# EAGLE design Schemat (EAGLE 6.1)
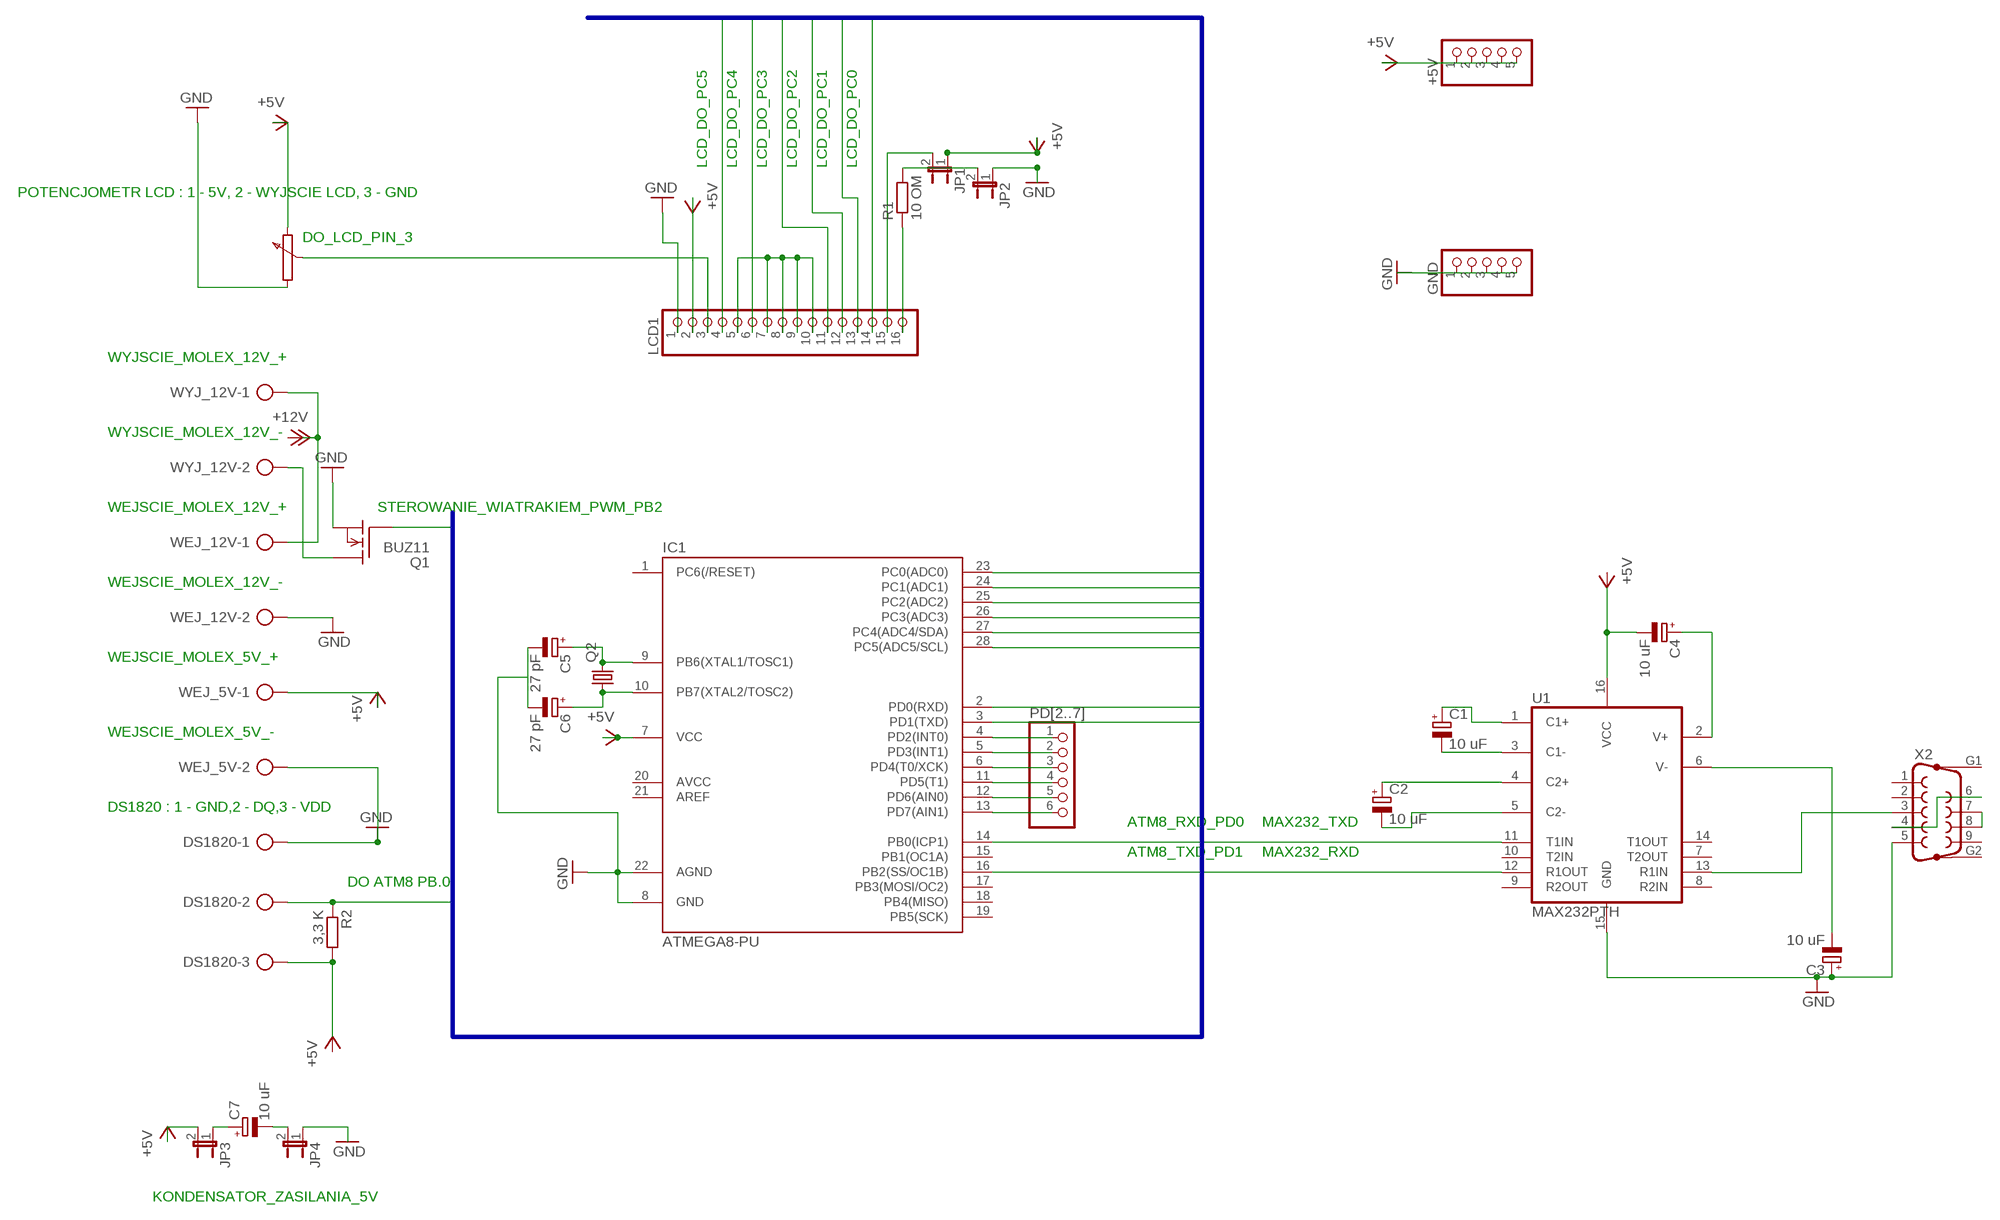
[diagram p0: schematic, sheet 1]

## Parts
+5V  PINHD-1X5  [1X05]
C1  10 uF  CPOL-EUE5-10.5  [E5-10,5]
C2  10 uF  CPOL-EUE5-10.5  [E5-10,5]
C3  10 uF  CPOL-EUE5-10.5  [E5-10,5]
C4  10 uF  CPOL-EUE5-10.5  [E5-10,5]
C5  27 pF  CPOL-EUE5-10.5  [E5-10,5]
C6  27 pF  CPOL-EUE5-10.5  [E5-10,5]
C7  10 uF  CPOL-EUE5-10.5  [E5-10,5]
DS1820  AK500/3-H  [AK500/3-H]
GND  PINHD-1X5  [1X05]
IC1  ATMEGA8-PU  [DIL28-3]
JP1  JP1E  [JP1]
JP2  JP1E  [JP1]
JP3  JP1E  [JP1]
JP4  JP1E  [JP1]
LCD1  PINHD-1X16  [1X16]
PD[2..7]  PINHD-1X6  [1X06]
Q1  BUZ11  [TO220]
Q2  CRYSTALHC49S  [HC49/S]
R1  10 OM  R-EU_0207/15  [0207/15]
R2  3,3 K  R-EU_0207/15  [0207/15]
U1  MAX232PTH  [DIL16]
WEJ_5V  AK500/2-H  [AK500/2-H]
WEJ_12V  AK500/2-H  [AK500/2-H]
WYJ_12V  AK500/2-H  [AK500/2-H]
X2  F09HP  [F09HP]

## Nets
+5V: +5V.1 +5V.2 +5V.3 +5V.4 +5V.5 IC1.7(VCC) JP1.1 JP3.2 LCD1.2 WEJ_5V.1
GND: C3.+ C5.- C6.- DS1820.1 GND.1 GND.2 GND.3 GND.4 GND.5 IC1.8(GND) IC1.22(AGND) JP2.1 JP4.1 LCD1.1 Q1.3(S) U1.15(GND) WEJ_5V.2 WEJ_12V.2 X2.5
N$1: C1.- U1.3(C1-)
N$2: C1.+ U1.1(C1+)
N$3: C2.+ U1.4(C2+)
N$4: C2.- U1.5(C2-)
N$5: X2.4 X2.6
N$6: X2.7 X2.8
N$7: U1.13(R1IN) X2.3
N$8: C4.- U1.16(VCC)
N$9: C3.- U1.6(V-)
N$10: C4.+ U1.2(V+)
N$11: C7.+ JP3.1
N$12: C7.- JP4.2
N$13: IC1.4(PD2(INT0)) PD[2..7].1
N$14: IC1.5(PD3(INT1)) PD[2..7].2
N$15: DS1820.3 R2.2
N$16: IC1.6(PD4(T0/XCK)) PD[2..7].3
N$17: LCD1.3
N$18: WEJ_12V.1 WYJ_12V.1
N$19: IC1.11(PD5(T1)) PD[2..7].4
N$20: Q1.2(D) WYJ_12V.2
N$21: LCD1.5 LCD1.7 LCD1.8 LCD1.9 LCD1.10
N$22: IC1.12(PD6(AIN0)) PD[2..7].5
N$23: C5.+ IC1.9(PB6(XTAL1/TOSC1)) Q2.2
N$24: IC1.13(PD7(AIN1)) PD[2..7].6
N$29: JP1.2 LCD1.15
N$30: JP2.2 R1.2
N$32: C6.+ IC1.10(PB7(XTAL2/TOSC2)) Q2.1
N$33: LCD1.16 R1.1
PB0: DS1820.2 IC1.14(PB0(ICP1)) R2.1
PB2: IC1.16(PB2(SS/OC1B)) Q1.1(G)
PC0: IC1.23(PC0(ADC0)) LCD1.14
PC1: IC1.24(PC1(ADC1)) LCD1.13
PC2: IC1.25(PC2(ADC2)) LCD1.12
PC3: IC1.26(PC3(ADC3)) LCD1.11
PC4: IC1.27(PC4(ADC4/SDA)) LCD1.6
PC5: IC1.28(PC5(ADC5/SCL)) LCD1.4
PD0: IC1.2(PD0(RXD)) U1.11(T1IN)
PD1: IC1.3(PD1(TXD)) U1.12(R1OUT)
Unconnected: IC1.1(PC6(/RESET)) IC1.15(PB1(OC1A)) IC1.17(PB3(MOSI/OC2)) IC1.18(PB4(MISO)) IC1.19(PB5(SCK)) IC1.20(AVCC) IC1.21(AREF) U1.7(T2OUT) U1.8(R2IN) U1.9(R2OUT) U1.10(T2IN) U1.14(T1OUT) X2.1 X2.2 X2.9 X2.G1 X2.G2

## Buses
PB[0..7],PC[0..6],PD[0..7]

## Notes on the sheet
- LCD_DO_PC5 | LCD_DO_PC4 | LCD_DO_PC3 | LCD_DO_PC2 | LCD_DO_PC1 | LCD_DO_PC0
- POTENCJOMETR LCD : 1 - 5V, 2 - WYJSCIE LCD, 3 - GND
- DO_LCD_PIN_3
- WYJSCIE_MOLEX_12V_+
- WYJSCIE_MOLEX_12V_-
- WEJSCIE_MOLEX_12V_+ | STEROWANIE_WIATRAKIEM_PWM_PB2
- WEJSCIE_MOLEX_12V_-
- WEJSCIE_MOLEX_5V_+
- WEJSCIE_MOLEX_5V_-
- DS1820 : 1 - GND,2 - DQ,3 - VDD
- ATM8_RXD_PD0 | MAX232_TXD
- ATM8_TXD_PD1 | MAX232_RXD
- DO ATM8 PB.0
- KONDENSATOR_ZASILANIA_5V

## Library data of the parts
+5V GND = pinhead:PINHD-1X5: PIN HEADER
C1-C7 = rcl:CPOL-EU: POLARIZED CAPACITOR, European symbol
DS1820 = con-ptr500:AK500/3-H: CONNECTOR Aug. 2004 / PTR Meßtechnik: Die Bezeichnung der Serie AK505 wurde geändert. Es handelt sich hierbei um AK500 in horizontaler Ausführung.; OC_FARNELL: unknown; OC_NEWARK: unknown
IC1 = atmega8:ATMEGA8-PU
JP1-JP4 = jumper:JP1E: JUMPER
LCD1 = pinhead:PINHD-1X16: PIN HEADER
PD[2..7] = pinhead:PINHD-1X6: PIN HEADER
Q1 = transistor-fet:BUZ11: N-Channel Enhancement MOSFET 50V; 30A; 0,040Ohm
Q2 = crystal:CRYSTAL: CRYSTAL; OC_FARNELL: 1667008; OC_NEWARK: unknown
R1 R2 = rcl:R-EU_: RESISTOR, European symbol
U1 = SparkFun:MAX232: RS232 Transceiver Very common IC. This is generically called 'MAX232', but works with the 3V equivalent MAX3232 generic ICs. Field tested and mother approved. Spark Fun Electronics SKU : COM-00316 (DIP) and COM-00589 (SMD)
WEJ_5V WEJ_12V WYJ_12V = con-ptr500:AK500/2-H: CONNECTOR Aug. 2004 / PTR Meßtechnik: Die Bezeichnung der Serie AK505 wurde geändert. Es handelt sich hierbei um AK500 in horizontaler Ausführung.; OC_FARNELL: unknown; OC_NEWARK: unknown
X2 = con-subd:F09HP: SUB-D; OC_FARNELL: unknown; OC_NEWARK: unknown

## Board
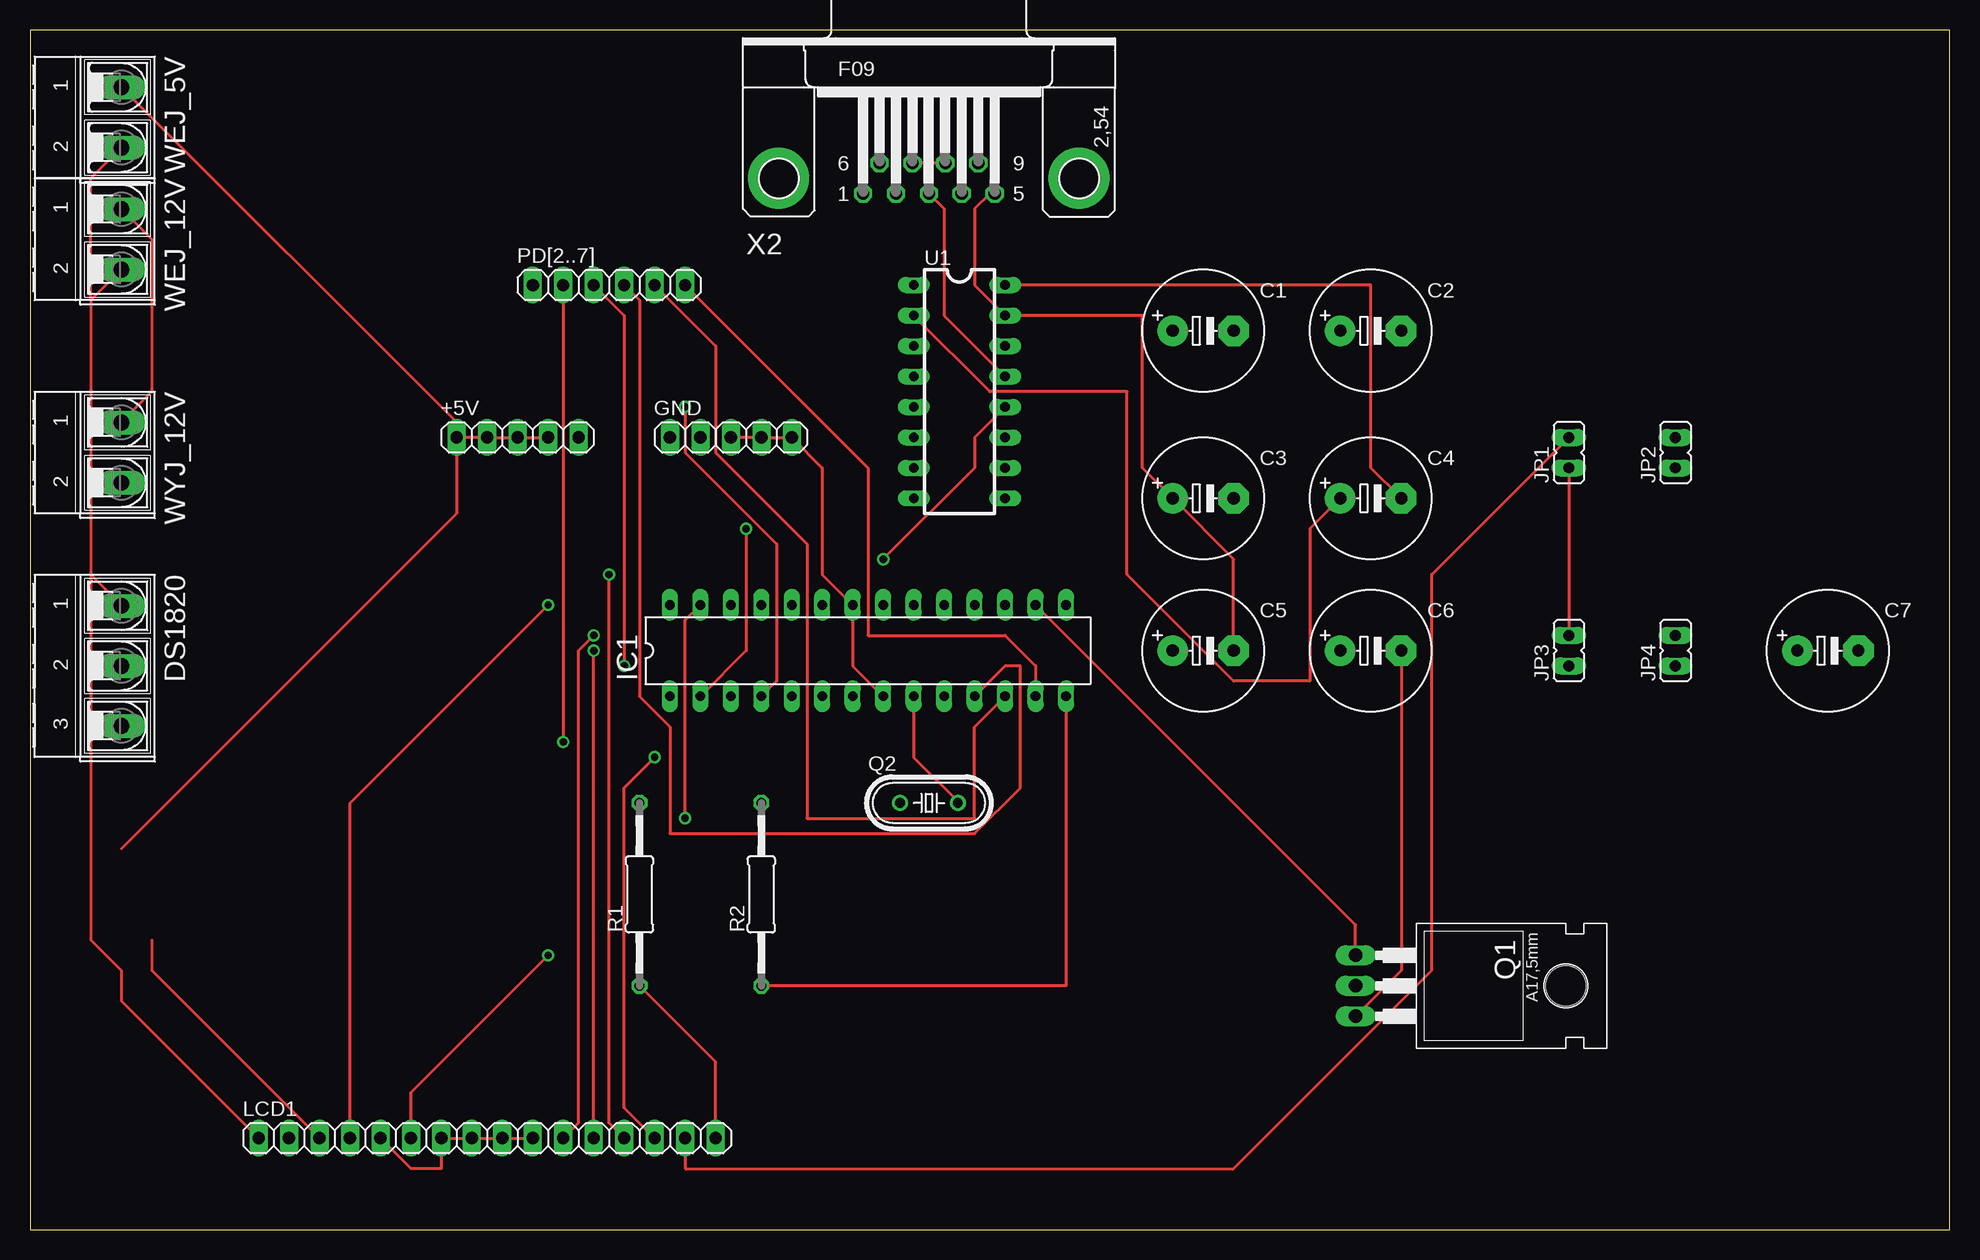
[diagram p1: board, top side]
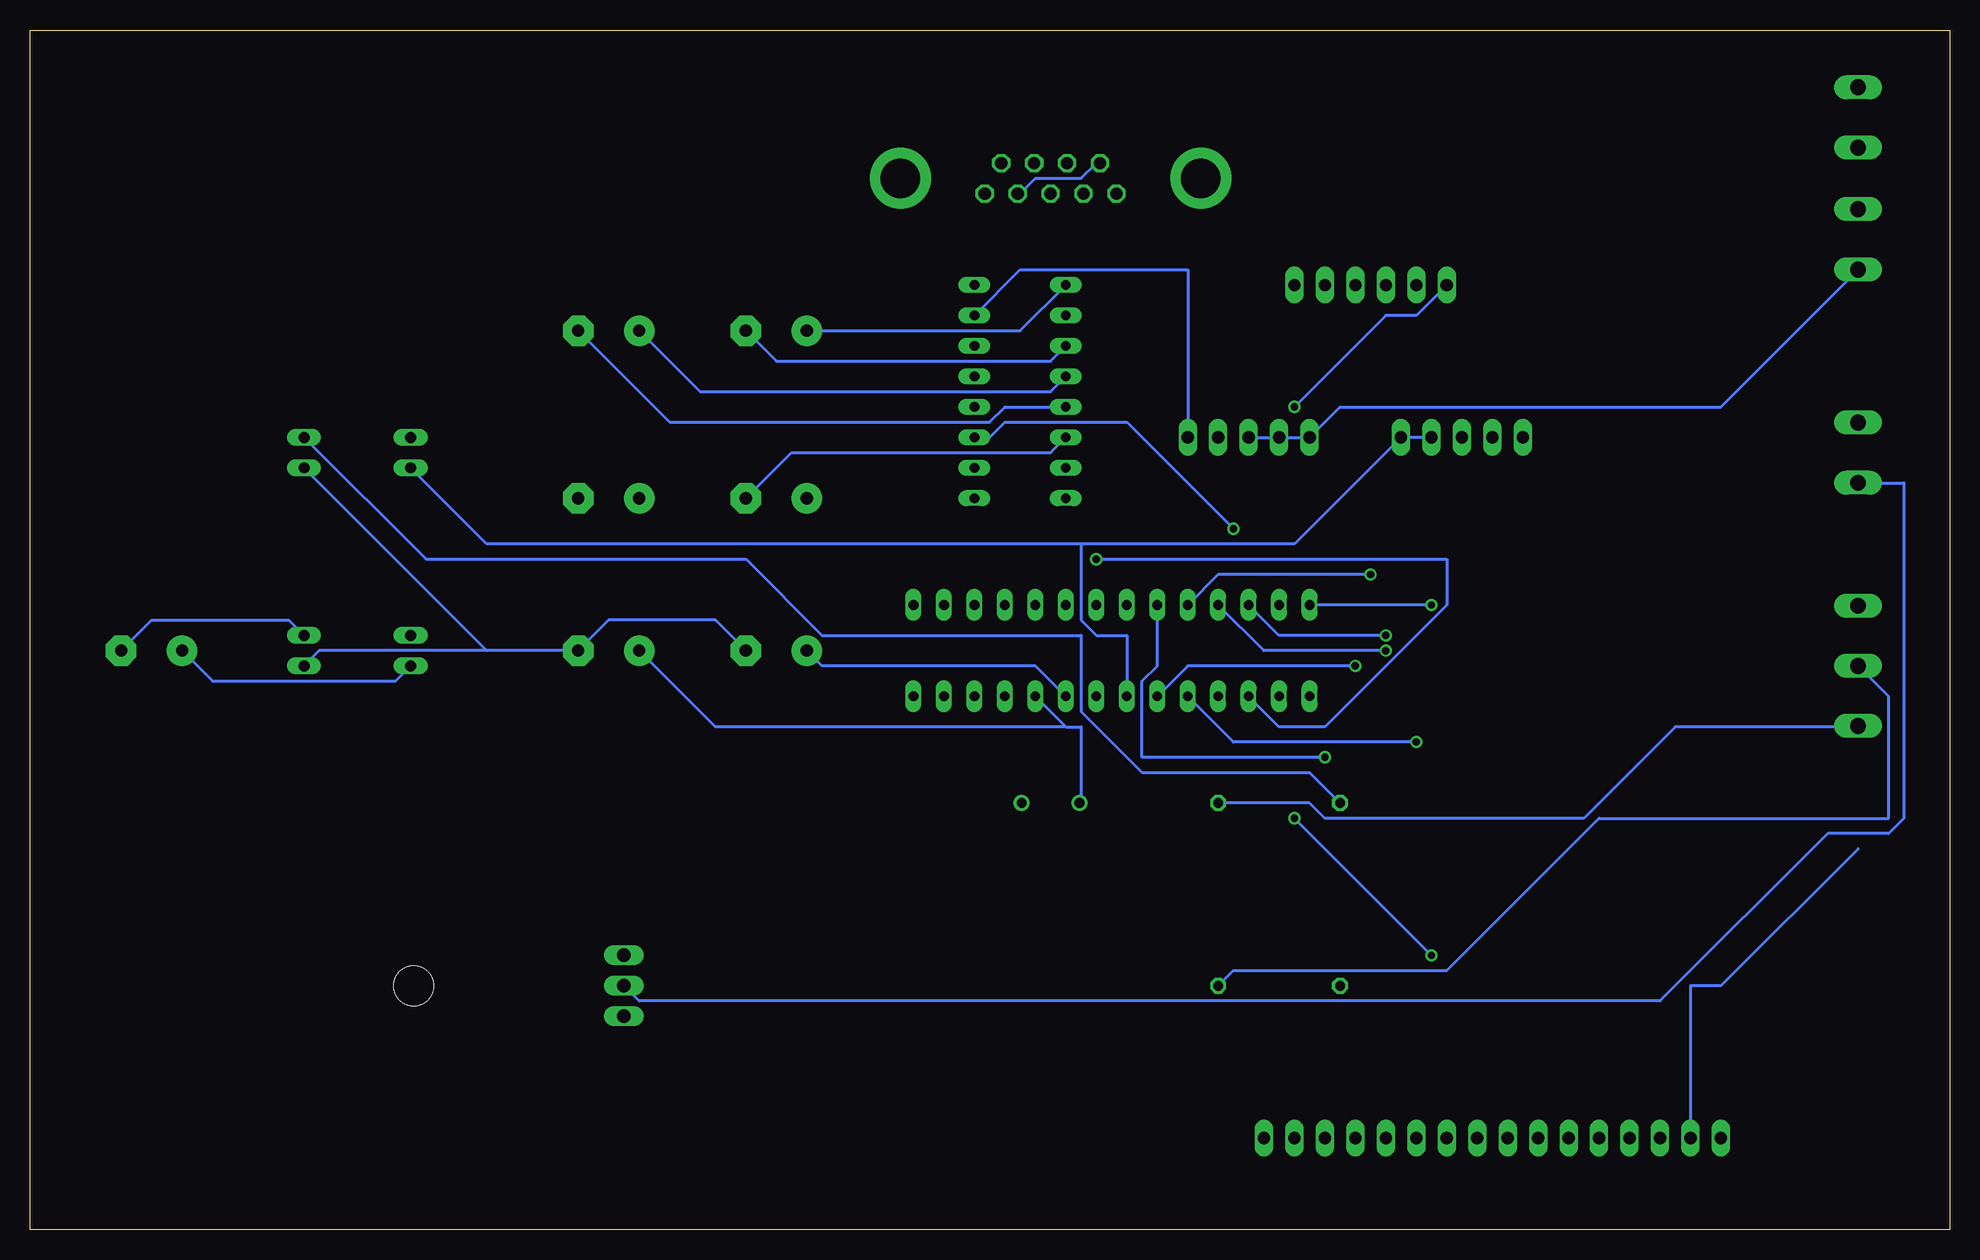
[diagram p2: board, bottom side, seen from below]

Size 160 x 100 mm. Coordinates in mm from the lower left corner, seen from the top.
Outline: 0,0 160,0 160,100 0,100 0,0
Copper layers (1*16): Top 0.035mm / dielectric 1.5mm / Bottom 0.035mm
Design rules: minimum track width 10mil, minimum drill 24mil, track to track 8mil, track to pad 8mil, pad to pad 8mil, via to via 8mil, smd to smd 8mil, copper to edge 40mil, drill to drill 8mil, minimum pad ring 10mil, minimum via ring 8mil, stop-mask expansion 4mil, vias tented up to drill 0mil, thermal gap 10mil

### Footprints (pad centres in the part's own frame; a part is rotated, then mirrored left to right if it is on the bottom)
1X05 = drill 1.016 long: 1 -5.08,0; 2 -2.54,0; 3 0,0; 4 2.54,0; 5 5.08,0
E5-10,5 = drill 1.016 pad 2.54: + -2.54,0 | drill 1.016 pad 2.54 octagon: - 2.54,0
AK500/3-H = drill 1.321 long: 1 -5.004,0; 2 0,0; 3 5.004,0
DIL28-3 = drill 0.813 long: 1 -16.51,-3.81; 2 -13.97,-3.81; 3 -11.43,-3.81; 4 -8.89,-3.81; 5 -6.35,-3.81; 6 -3.81,-3.81; 7 -1.27,-3.81; 8 1.27,-3.81; 9 3.81,-3.81; 10 6.35,-3.81; 11 8.89,-3.81; 12 11.43,-3.81; 13 13.97,-3.81; 14 16.51,-3.81; 15 16.51,3.81; 16 13.97,3.81; 17 11.43,3.81; 18 8.89,3.81; 19 6.35,3.81; 20 3.81,3.81; 21 1.27,3.81; 22 -1.27,3.81; 23 -3.81,3.81; 24 -6.35,3.81; 25 -8.89,3.81; 26 -11.43,3.81; 27 -13.97,3.81; 28 -16.51,3.81
JP1 = drill 0.914 long: 1 0,-1.27; 2 0,1.27
1X16 = drill 1.016 long: 1 -19.05,0; 2 -16.51,0; 3 -13.97,0; 4 -11.43,0; 5 -8.89,0; 6 -6.35,0; 7 -3.81,0; 8 -1.27,0; 9 1.27,0; 10 3.81,0; 11 6.35,0; 12 8.89,0; 13 11.43,0; 14 13.97,0; 15 16.51,0; 16 19.05,0
1X06 = drill 1.016 long: 1 -6.35,0; 2 -3.81,0; 3 -1.27,0; 4 1.27,0; 5 3.81,0; 6 6.35,0
TO220 = drill 1.118 long: 1 -2.54,-6.35; 2 0,-6.35; 3 2.54,-6.35 | hole 3.302: 0,11.176
HC49/S = drill 0.813: 1 -2.413,0; 2 2.413,0
0207/15 = drill 0.813 octagon: 1 -7.62,0; 2 7.62,0
DIL16 = drill 0.813 long: 1 -8.89,-3.81; 2 -6.35,-3.81; 3 -3.81,-3.81; 4 -1.27,-3.81; 5 1.27,-3.81; 6 3.81,-3.81; 7 6.35,-3.81; 8 8.89,-3.81; 9 8.89,3.81; 10 6.35,3.81; 11 3.81,3.81; 12 1.27,3.81; 13 -1.27,3.81; 14 -3.81,3.81; 15 -6.35,3.81; 16 -8.89,3.81
AK500/2-H = drill 1.321 long: 1 -2.515,0; 2 2.515,0
F09HP = drill 1.016 octagon: 1 -5.486,-1.27; 2 -2.743,-1.27; 3 0,-1.27; 4 2.743,-1.27; 5 5.486,-1.27; 6 -4.115,1.27; 7 -1.372,1.27; 8 1.372,1.27; 9 4.115,1.27 | drill 3.302 pad 5.08: G1 -12.522,0; G2 12.522,0

### Placement (x,y rotation side)
+5V  40.64,66.04 0 top
C1  97.79,74.93 0 top
C2  111.76,74.93 0 top
C3  97.79,60.96 0 top
C4  111.76,60.96 0 top
C5  97.79,48.26 0 top
C6  111.76,48.26 0 top
C7  149.86,48.26 0 top
DS1820  7.62,46.99 270 top
GND  58.42,66.04 0 top
IC1  69.85,48.26 0 top
JP1  128.27,64.77 0 top
JP2  137.16,64.77 0 top
JP3  128.27,48.26 0 top
JP4  137.16,48.26 0 top
LCD1  38.1,7.62 0 top
PD[2..7]  48.26,78.74 0 top
Q1  116.84,20.32 270 top
Q2  74.93,35.56 0 top
R1  50.8,27.94 90 top
R2  60.96,27.94 90 top
U1  77.47,69.85 270 top
WEJ_5V  7.62,92.71 270 top
WEJ_12V  7.62,82.55 270 top
WYJ_12V  7.62,64.77 270 top
X2  74.93,87.63 0 top

### Tracks (layer width: path | path; a pad name or v marks a point on that pad's centre or on a via)
+5V  (1 unrouted)
  Top 0.254: JP1.1 JP3.2 | +5V.1 +5V.2 +5V.3 +5V.4 | +5V.1 35.56,67.31 7.62,95.25 WEJ_5V.1 | 7.62,31.75 35.56,59.69 +5V.1
  Bottom 0.254: IC1.7 68.58,49.53 71.12,49.53 72.39,50.8 72.39,57.15 | 72.39,57.15 54.61,57.15 +5V.5 +5V.4 | JP1.1 121.92,57.15 72.39,57.15 | LCD1.2 21.59,20.32 19.05,20.32 7.62,31.75
GND
  Top 0.254: LCD1.1 7.62,19.05 7.62,21.59 5.08,24.13 5.08,54.61 | 5.08,54.61 7.62,52.07 DS1820.1 | 5.08,77.47 5.08,54.61 | 5.08,77.47 7.62,80.01 WEJ_12V.2 | 5.08,77.47 5.08,87.63 7.62,90.17 WEJ_5V.2 | Q1.3 114.3,21.59 C6.- | IC1.8 68.58,46.99 IC1.22 66.04,54.61 66.04,63.5 GND.5 GND.4 GND.3 | X2.5 80.01,86.36 78.74,85.09 78.74,78.74 U1.15 92.71,76.2 92.71,63.5 C3.+ 100.33,55.88 C5.-
  Bottom 0.254: JP4.1 135.89,48.26 121.92,48.26 | 121.92,48.26 C6.- 111.76,50.8 102.87,50.8 C5.- | 121.92,48.26 JP2.1 | GND.3 GND.2 GND.1 50.8,68.58 19.05,68.58 7.62,80.01 WEJ_12V.2 | GND.5 63.5,80.01 77.47,80.01 U1.15
N$1
  Bottom 0.254: U1.3 74.93,72.39 97.79,72.39 C1.-
N$2
  Bottom 0.254: U1.1 77.47,74.93 C1.+
N$3
  Bottom 0.254: U1.4 74.93,69.85 104.14,69.85 C2.+
N$4
  Bottom 0.254: U1.5 78.74,68.58 80.01,67.31 106.68,67.31 C2.-
N$5
  Bottom 0.254: X2.6 71.12,88.9 72.39,87.63 76.2,87.63 77.47,86.36 X2.4
N$6
  Top 0.254: X2.8 X2.7
N$7
  Top 0.254: U1.13 76.2,76.2 76.2,85.09 X2.3
N$8
  Top 0.254: U1.16 111.76,78.74 111.76,63.5 C4.-
N$9
  Bottom 0.254: U1.6 74.93,64.77 96.52,64.77 C3.-
N$10
  Top 0.254: U1.2 80.01,69.85 91.44,69.85 91.44,54.61 100.33,45.72 106.68,45.72 106.68,58.42 C4.+
N$11
  Bottom 0.254: JP3.1 129.54,45.72 144.78,45.72 C7.+
N$12
  Bottom 0.254: JP4.2 138.43,50.8 149.86,50.8 C7.-
N$13  (via drill 0.61)
  Top 0.254: IC1.4 62.23,45.72 62.23,57.15 54.61,64.77 v54.61,68.58
  Bottom 0.254: v54.61,68.58 46.99,76.2 44.45,76.2 PD[2..7].1
N$14  (via drill 0.61)
  Top 0.254: PD[2..7].2 v44.45,40.64
  Bottom 0.254: IC1.5 59.69,40.64 v44.45,40.64
N$15
  Bottom 0.254: R2.2 53.34,35.56 52.07,34.29 30.48,34.29 22.86,41.91 7.62,41.91 DS1820.3
N$16  (via drill 0.61)
  Top 0.254: v49.53,46.99 49.53,76.2 PD[2..7].3
  Bottom 0.254: IC1.6 63.5,46.99 v49.53,46.99
N$17
  Top 0.254: LCD1.3 10.16,21.59 10.16,24.13
N$18
  Top 0.254: WYJ_12V.1 7.62,67.31 10.16,69.85 10.16,82.55 7.62,85.09 WEJ_12V.1
N$19
  Top 0.254: IC1.11 81.28,46.99 82.55,46.99 82.55,36.83 78.74,33.02 53.34,33.02 53.34,41.91 50.8,44.45 50.8,77.47 PD[2..7].4
N$20
  Bottom 0.254: Q1.2 109.22,19.05 24.13,19.05 10.16,33.02 5.08,33.02 3.81,34.29 3.81,62.23 7.62,62.23 WYJ_12V.2
N$21
  Top 0.254: LCD1.5 31.75,5.08 34.29,5.08 LCD1.7 LCD1.8 LCD1.9 LCD1.10
N$22
  Top 0.254: IC1.12 78.74,41.91 78.74,34.29 64.77,34.29 64.77,57.15 57.15,64.77 57.15,73.66 PD[2..7].5
N$23
  Top 0.254: IC1.9 73.66,39.37 77.47,35.56 Q2.2
  Bottom 0.254: C5.+ 93.98,46.99 76.2,46.99 IC1.9
N$24
  Top 0.254: IC1.13 83.82,46.99 81.28,49.53 69.85,49.53 69.85,63.5 PD[2..7].6
N$29
  Top 0.254: JP1.2 116.84,54.61 116.84,21.59 100.33,5.08 54.61,5.08 LCD1.15
N$30
  Bottom 0.254: R1.2 53.34,38.1 67.31,38.1 72.39,43.18 72.39,49.53 93.98,49.53 100.33,55.88 127,55.88 JP2.2
N$32
  Bottom 0.254: 73.66,41.91 72.39,41.91 72.39,35.56 Q2.1 | IC1.10 73.66,41.91 | C6.+ 102.87,41.91 73.66,41.91
N$33
  Top 0.254: R1.1 57.15,13.97 LCD1.16
PB0
  Top 0.254: R2.1 86.36,20.32 IC1.14
  Bottom 0.254: DS1820.2 5.08,44.45 5.08,34.29 29.21,34.29 41.91,21.59 59.69,21.59 R2.1
PB2
  Top 0.254: IC1.16 110.49,25.4 Q1.1
PC0  (via drill 0.61)
  Top 0.254: v52.07,39.37 49.53,36.83 49.53,10.16 LCD1.14
  Bottom 0.254: IC1.23 66.04,46.99 67.31,45.72 67.31,39.37 v52.07,39.37
PC1  (via drill 0.61)
  Top 0.254: v48.26,54.61 48.26,8.89 LCD1.13
  Bottom 0.254: IC1.24 60.96,54.61 v48.26,54.61
PC2  (via drill 0.61)
  Top 0.254: LCD1.12 v46.99,48.26
  Bottom 0.254: IC1.25 57.15,48.26 v46.99,48.26
PC3  (via drill 0.61)
  Top 0.254: v46.99,49.53 45.72,48.26 45.72,8.89 LCD1.11
  Bottom 0.254: IC1.26 55.88,49.53 v46.99,49.53
PC4  (via drill 0.61)
  Top 0.254: IC1.27 54.61,50.8 v54.61,34.29 | v43.18,22.86 31.75,11.43 LCD1.6
  Bottom 0.254: v43.18,22.86 v54.61,34.29
PC5  (via drill 0.61)
  Top 0.254: v43.18,52.07 26.67,35.56 LCD1.4
  Bottom 0.254: v43.18,52.07 IC1.28
PD0  (via drill 0.61)
  Top 0.254: IC1.2 59.69,48.26 v59.69,58.42
  Bottom 0.254: v59.69,58.42 68.58,67.31 78.74,67.31 80.01,66.04 U1.11
PD1  (via drill 0.61)
  Top 0.254: v71.12,55.88 78.74,63.5 78.74,66.04 U1.12
  Bottom 0.254: IC1.3 55.88,41.91 52.07,41.91 41.91,52.07 41.91,55.88 v71.12,55.88

### Text on the board
Reference: WEJ 5V + | STEROWNIK UKŁADU CHŁODZENIA SERWERA | PROJEKT INŻ. GRZEGORZ PŁONKA | WEJ 5V - | WEJ 12V + | WEJ 12V - | C1 - C4 - KONDENSATORY DO | PINY OD PD.2 - PD.7 | MAX232 | WYJ 12V + | WYJ 12V - | JP1, JP2 - ZWORKI PODŚW. LCD | DS1820 : 1 - GND | DS1820 : 2 - DQ (PB.0) | DS1820 : 3 - VDD | JP3, JP4 - ZWORKI KOND. ZAS. | C5, C6 - KONDENSATORY | KWARCA | KONTR : 1 - 5V | KONTR : 2 - DO LCD | KONTR : 3 - GND
tDocu: +5V | GND